# Altium schematic sheet SHT40.SchDoc
size A4; SheetNumber: 1; SheetTotal: 1
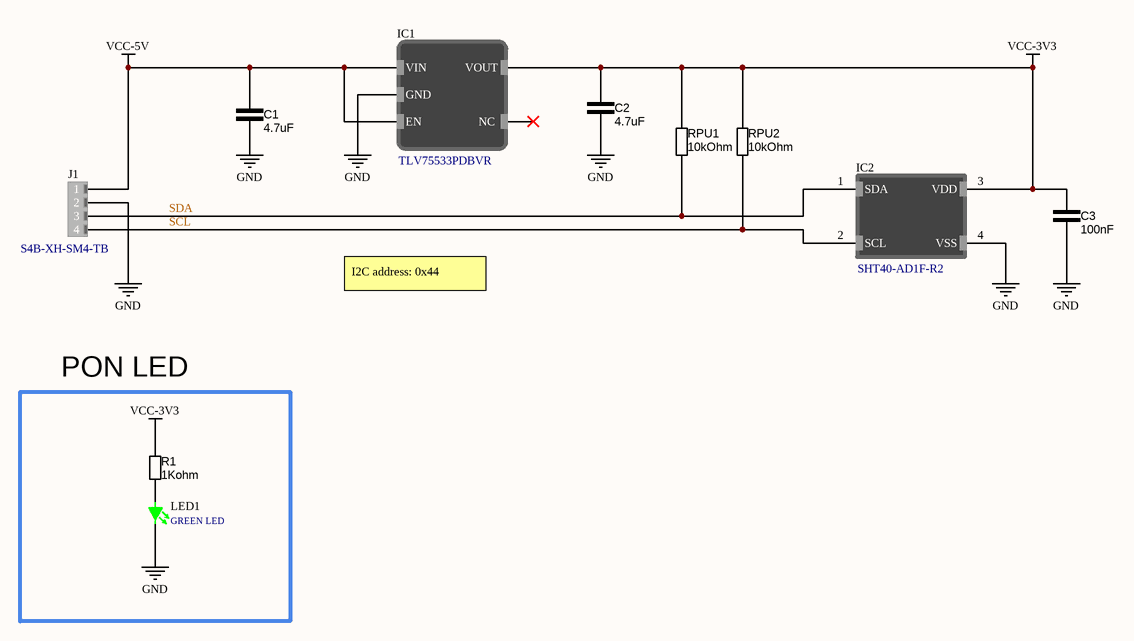
[diagram p0: SHT40.SchDoc]

## Parts
C1  4.7uF  [CAP_0805]
C2  4.7uF  [CAP_0805]
C3  100nF  [CAP_0603]
IC1  TLV75533PDBVR  [SOT23_5]
IC2  SHT40-AD1F-R2  [SHT4X]
J1  S4B-XH-SM4-TB  [JST_S4B-XH-SM4-TB]
LED1  GREEN LED  [DIOC1608X04N]
R1  1Kohm  [RES_0603]
RPU1  10kOhm  [RES_0603]
RPU2  10kOhm  [RES_0603]

## Blocks framed on the sheet
PON LED: LED1 R1

## Nets
GND: C1.1 C2.1 C3.1 IC1.2(GND) IC2.4(VSS) J1.2 LED1.2
VCC-3V3: C2.2 C3.2 IC1.5(VOUT) IC2.3(VDD) R1.2 RPU1.2 RPU2.2
VCC-5V: C1.2 IC1.1(VIN) IC1.3(EN) J1.1
SCL: IC2.2(SCL) J1.4 RPU2.1
SDA: IC2.1(SDA) J1.3 RPU1.1
NetLED1_1: LED1.1 R1.1

Not connected (* = marked no-connect by the designer): IC1 4(NC)*

## Notes on the sheet
- I2C address: 0x44

## Library data of the parts
C1 C2 = C000003: 4.7 µF ±10% 25V Ceramic Capacitor X5R 0805 (2012 Metric); Manufacturer Product Number: C0805C475K3PACTU; capacitance: 4.7uF; ComponentLink1Description: DigiKey; ComponentLink1URL: https://www.digikey.com/en/products/detail/kemet/C0805C475K3PAC7800/1950665; DigiKey Part Number: 399-C0805C475K3PACTUCT-ND; JLCPCB Part Number: C1779
C3 = C000007: 0.1 µF ±10% 25V Ceramic Capacitor X7R 0603 (1608 Metric); Manufacturer Product Number: KAM15AR71E104KT; capacitance: 100nF; ComponentLink1Description: DigiKey; ComponentLink1URL: https://www.digikey.com/en/products/detail/kyocera-avx/06033C104K4T2A/8019250; DigiKey Part Number: 478-KAM15AR71E104KTCT-ND; JLCPCB Part Number: C1590
IC1 = TLV75533PDBVR: Linear Voltage Regulator IC Positive Fixed 1 Output 500mA SOT-23-5; DigiKey Part Number: 296-50411-1-ND; ComponentLink1Description: DigiKey; ComponentLink1URL: https://www.digikey.com/en/products/detail/texas-instruments/TLV75533PDBVR/9356541; Mouser Part Number: 595-TLV75533PDBVR; ComponentLink2Description: Mouser; ComponentLink2URL: https://eu.mouser.com/ProductDetail/Texas-Instruments/TLV75533PDBVR?qs=55YtniHzbhAKEwqeO2xJXQ%3D%3D; Manufacturer Product Number: TLV75533PDBVR; JLCPCB Part Number: C404027
IC2 = SHT40-AD1F-R2: Humidity, Temperature 0 ~ 100% RH I2C ±1.8% RH 4 s Surface Mount; DigiKey Part Number: 1649-SHT40-AD1F-R2CT-ND; Mouser Part Number: 403-SHT40-AD1F-R2; Manufacturer Product Number: SHT40-AD1F-R2; JLCPCB Part Number: C7461846; ComponentLink1Description: DigiKey; ComponentLink1URL: https://www.digikey.com/en/products/detail/sensirion-ag/SHT40-AD1F-R2/17180863?s=N4IgTCBcDaIMoAkAqAWADAWgIIBECMAYhgEoQC6AvkA; ComponentLink2Description: Mouser; ComponentLink2URL: https://eu.mouser.com/ProductDetail/Sensirion/SHT40-AD1F-R2?qs=rQFj71Wb1eVPr6MxV5k7AQ%3D%3D
J1 = 00000018: Connector Header Surface Mount, Right Angle 4 position 0.098" (2.50mm); DigiKey Part Number: 455-2262-1-ND; ComponentLink1Description: DigiKey; ComponentLink1URL: https://www.digikey.com/en/products/detail/jst-sales-america-inc/S4B-XH-SM4-TB/1651064; Manufacturer Product Number: S4B-XH-SM4-TB; Mouser Part Number: 306-S4BXHSM4TBLFSN; JLCPCB Part Number: C161861; ComponentLink2Description: Mouser; ComponentLink2URL: https://eu.mouser.com/ProductDetail/JST-Commercial/S4B-XH-SM4-TBLFSN?qs=QpmGXVUTftFIPbbIXV0K6A%3D%3D
LED1 = 00000001: LED GREEN DIFFUSED 0603 SMD; Supplier 1: Avnet; Supplier Part Number 1: Q65111A3964; ComponentLink1Description: Digikey; ComponentLink1URL: https://www.digikey.com/en/products/detail/ams-osram-usa-inc/LG-Q396-PS-35/5249855
R1 = R000004: RES 1K OHM 1% 1/10W 0603; resistance: 1Kohm; ComponentLink1Description: digikey; ComponentLink1URL: https://www.digikey.com/en/products/detail/vishay-beyschlag-draloric-bc-components/MCT06030C1001FP500/2607821
RPU1 RPU2 = R000001: 10 kOhms ±1% 0.125W, 1/8W Chip Resistor 0603 (1608 Metric) Anti-Sulfur Thin Film; Manufacturer Product Number: MCT06030C1002FP500; resistance: 10kOhm; ComponentLink1Description: DigiKey; ComponentLink1URL: https://www.digikey.com/en/products/detail/vishay-beyschlag-draloric-bc-components/MCT06030C1002FP500/1850440; DigiKey Part Number: MCT0603-10.0K-CFCT-ND